# Altium project TeensyCANcaper.PrjPcb
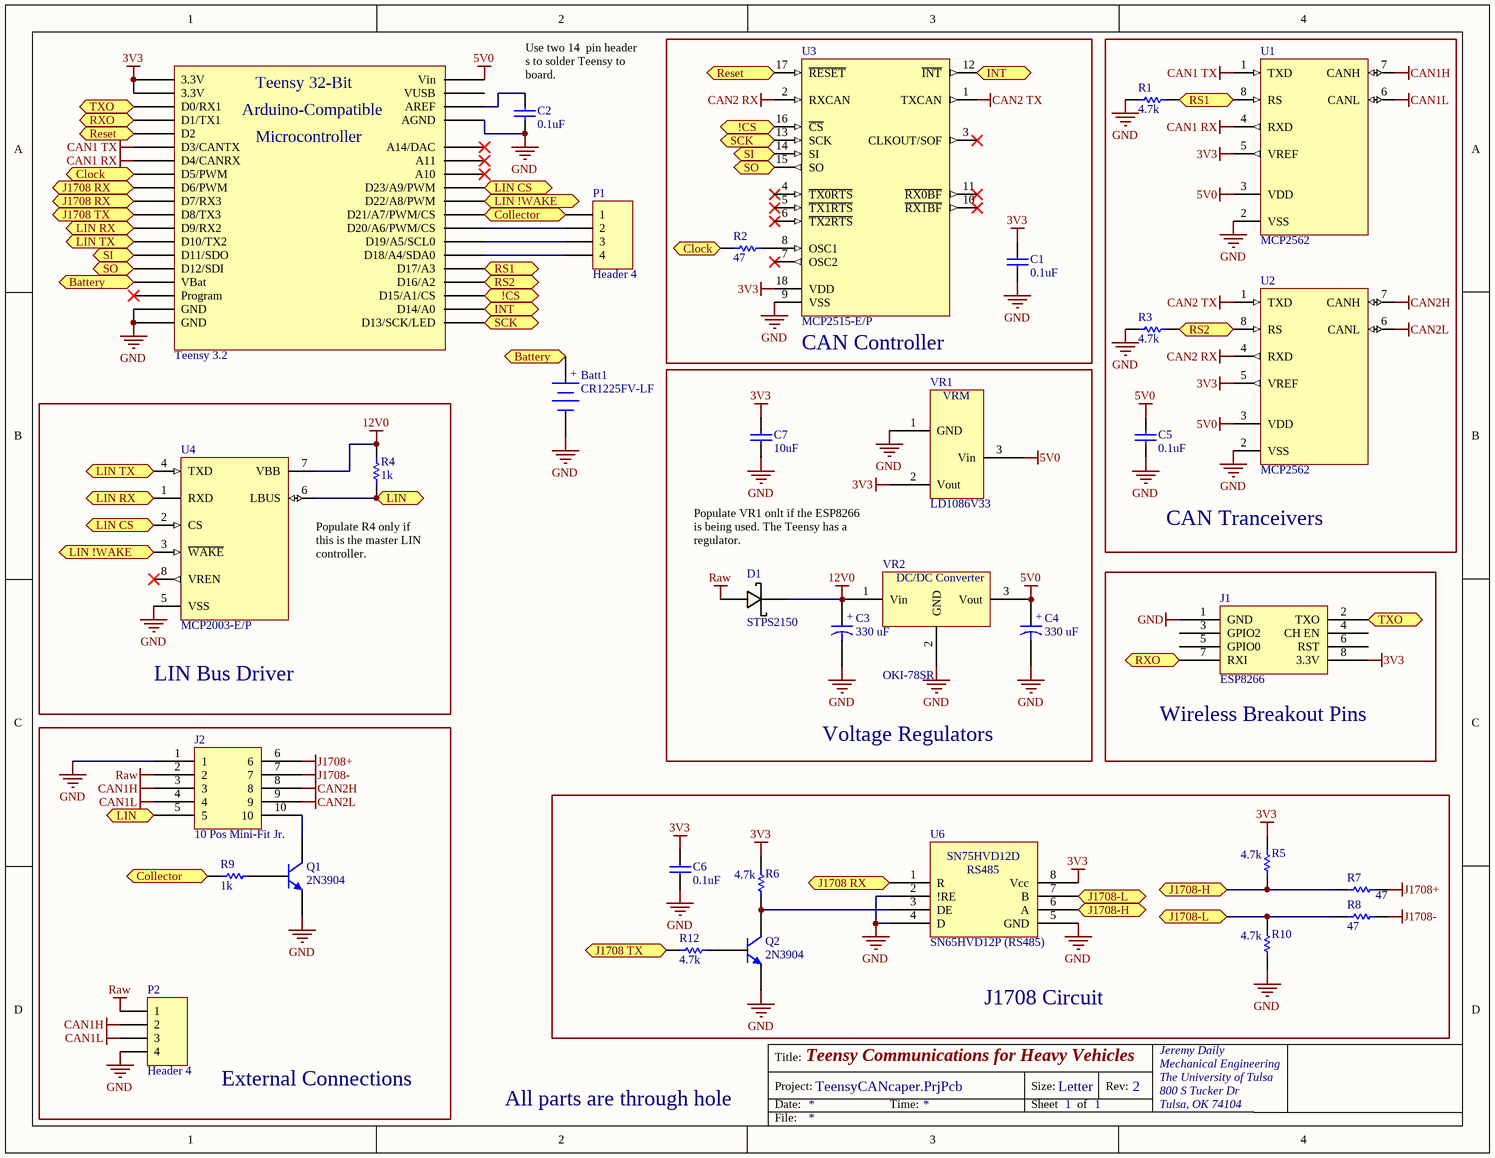
[diagram p0: TeensyJ1939v2.SchDoc]
1 sheet, 34 parts. Net scope: flat (ports and power ports of the same name join across sheets).
Board file: TeensyJ1939v2.PcbDoc

## Sheet TeensyJ1939v2.SchDoc: Teensy Communications for Heavy Vehicles
size Letter; Author: Jeremy Daily; Organization: Mechanical Engineering; Address1: The University of Tulsa; Address2: 800 S Tucker Dr; Address3: Tulsa, OK 74104; Revision: 2; SheetNumber: 1; SheetTotal: 1

### Parts
Batt1  CR1225FV-LF  [Coin Cell with Tabs]
BRD1  Teensy 3.2  [Teensy]
C1  0.1uF  [RAD-0.2]
C2  0.1uF  [RAD-0.2]
C3  330 uF  [Elec. Cap 5 x 10mm]
C4  330 uF  [Elec. Cap 5 x 10mm]
C5  0.1uF  [RAD-0.2]
C6  0.1uF  [RAD-0.2]
C7  10uF  [RAD-0.2]
D1  STPS2150  [DIODE-0.7]
J1  ESP8266  [ESP8266]
J2  10 Pos Mini-Fit Jr.  [10 pos Mini-Fit Jr. R/A Header]
P1  Header 4  [HDR1X4]
P2  Header 4  [HDR1X4]
Q1  2N3904  [TO-92A]
Q2  2N3904  [TO-92A]
R1  4.7k  [Axial-0.4]
R2  47  [Axial-0.4]
R3  4.7k  [Axial-0.4]
R4  1k  [Axial-0.4]
R5  4.7k  [Axial-0.4]
R6  4.7k  [Axial-0.4]
R7  47  [Axial-0.4]
R8  47  [Axial-0.4]
R9  1k  [Axial-0.4]
R10  4.7k  [Axial-0.4]
R12  4.7k  [Axial-0.4]
U1  MCP2562  [PDIP300-P8]
U2  MCP2562  [PDIP300-P8]
U3  MCP2515-E/P  [PDIP300-P18]
U4  MCP2003-E/P  [DIP8]
U6  SN65HVD12P (RS485)  [DIP8]
VR1  LD1086V33  [TO-220AB]
VR2  OKI-78SR  [TO-220AB]

### Blocks framed on the sheet
CAN Controller: C1 R2 U3
CAN Tranceivers: C5 R1 R3 U1 U2
LIN Bus Driver: R4 U4
Voltage Regulators: C3 C4 C7 D1 VR1 VR2
Wireless Breakout Pins: J1
External Connections: J2 P2 Q1 R9
J1708 Circuit: C6 Q2 R5-R8 R10 R12 U6

### Ports
!CS, Battery, Clock, Collector, INT, J1708 RX, J1708 TX, J1708-H, J1708-L, LIN, LIN !WAKE, LIN CS, LIN RX, LIN TX, Reset, RS1, RS2, RXO, SCK, SI, SO, TXO

### Nets
3V3: BRD1.16(3.3V) BRD1.31(3.3V) C1.2 C6.2 C7.2 J1.8(3.3V) R5.1 R6.1 U1.5(VREF) U2.5(VREF) U3.18(VDD) U6.8(Vcc) VR1.2(Vout)
5V0: BRD1.33(Vin) C4.1 C5.2 U1.3(VDD) U2.3(VDD) VR1.3(Vin) VR2.3(Vout)
12V0: C3.1 D1.2(K) R4.1 U4.7(VBB) VR2.1(Vin)
CAN1 RX: BRD1.9(D4/CANRX) U1.4(RXD)
CAN1 TX: BRD1.10(D3/CANTX) U1.1(TXD)
CAN1H: J2.3 P2.2 U1.7(CANH)
CAN1L: J2.4 P2.3 U1.6(CANL)
CAN2 RX: U2.4(RXD) U3.2(RXCAN)
CAN2 TX: U2.1(TXD) U3.1(TXCAN)
CAN2H: J2.8 U2.7(CANH)
CAN2L: J2.9 U2.6(CANL)
GND: Batt1.2(-) BRD1.14(GND) BRD1.17(GND) BRD1.32(AGND) C1.1 C2.1 C3.2(-) C4.2(-) C5.1 C6.1 C7.1 J1.1(GND) J2.1 P2.4 Q1.1(E) Q2.1(E) R1.1 R3.1 R10.2 U1.2(VSS) U2.2(VSS) U3.9(VSS) U4.5(VSS) U6.2(!RE) U6.4(D) U6.5(GND) VR1.1(GND) VR2.2(GND)
J1708+: J2.6 R7.2
J1708-: J2.7 R8.2
Raw: D1.1(A) J2.2 P2.1
NetBatt1_1: Batt1.1(+) BRD1.15(VBat) ; port Battery
NetBRD1_1: BRD1.1(D12/SDI) U3.15(SO) ; port SO
NetBRD1_2: BRD1.2(D11/SDO) U3.14(SI) ; port SI
NetBRD1_3: BRD1.3(D10/TX2) U4.4(TXD) ; port LIN TX
NetBRD1_4: BRD1.4(D9/RX2) U4.1(RXD) ; port LIN RX
NetBRD1_5: BRD1.5(D8/TX3) R12.2 ; port J1708 TX
NetBRD1_6: BRD1.6(D7/RX3) BRD1.7(D6/PWM) U6.1(R) ; port J1708 RX
NetBRD1_8: BRD1.8(D5/PWM) R2.2 ; port Clock
NetBRD1_11: BRD1.11(D2) U3.17(~{RESET}) ; port Reset
NetBRD1_12: BRD1.12(D1/TX1) J1.7(RXI) ; port RXO
NetBRD1_13: BRD1.13(D0/RX1) J1.2(TXO) ; port TXO
NetBRD1_20: BRD1.20(D13/SCK/LED) U3.13(SCK) ; port SCK
NetBRD1_21: BRD1.21(D14/A0) U3.12(~{INT}) ; port INT
NetBRD1_22: BRD1.22(D15/A1/CS) U3.16(~{CS}) ; port !CS
NetBRD1_23: BRD1.23(D16/A2) R3.2 U2.8(RS) ; port RS2
NetBRD1_24: BRD1.24(D17/A3) R1.2 U1.8(RS) ; port RS1
NetBRD1_25: BRD1.25(D18/A4/SDA0) P1.4
NetBRD1_26: BRD1.26(D19/A5/SCL0) P1.3
NetBRD1_27: BRD1.27(D20/A6/PWM/CS) P1.2
NetBRD1_28: BRD1.28(D21/A7/PWM/CS) P1.1 R9.1 ; port Collector
NetBRD1_29: BRD1.29(D22/A8/PWM) U4.3(~{WAKE}) ; port LIN !WAKE
NetBRD1_30: BRD1.30(D23/A9/PWM) U4.2(CS) ; port LIN CS
NetBRD1_35: BRD1.35(AREF) C2.2
NetJ2_5: J2.5 R4.2 U4.6(LBUS) ; port LIN
NetJ2_10: J2.10 Q1.3(C)
NetQ1_2: Q1.2(B) R9.2
NetQ2_2: Q2.2(B) R12.1
NetQ2_3: Q2.3(C) R6.2 U6.3(DE)
NetR2_1: R2.1 U3.8(OSC1)
NetR5_2: R5.2 R7.1 U6.6(A) ; port J1708-H
NetR8_1: R8.1 R10.1 U6.7(B) ; port J1708-L

Not connected (* = marked no-connect by the designer): BRD1 18(Program)* 19(A14/DAC)* 34(VUSB) 36(A10)* 37(A11)*; J1 3(GPIO2) 4(CH_EN) 5(GPIO0) 6(RST); U3 3(CLKOUT/SOF)* 4(~{TX0RTS})* 5(~{TX1RTS})* 6(~{TX2RTS})* 7(OSC2)* 10(~{RX1BF})* 11(~{RX0BF})*; U4 8(VREN)*

### Notes on the sheet
- (near C2) Use two 14  pin header s to solder Teensy to board.
- Populate R4 only if this is the master LIN controller.
- Populate VR1 onlt if the ESP8266 is being used. The Teensy has a regulator.
- All parts are through hole
- Title:
- Project:
- Date:
- Time:
- Sheet
- Size:
- Letter
- of
- Rev:
- File:
- (in symbol 7805) DC/DC Converter
- (in symbol Electrolytic Cap) +
- (in symbol LD1086 VRM) VRM
- (in symbol SN75HVD12D (3.3v RS485)) SN75HVD12D; RS485
- (in symbol Teensy) Teensy 32-Bit; Arduino-Compatible; Microcontroller

### Library data of the parts
Batt1 = CR2032 Battery Holder: Coin Cell Battery 3V 2-PIN VERT 48mAh 12.5 x 2.5mm; Manufacturer: Renata; Supplier 1: Mouser; Supplier Part Number 1: 614-CR1225FV-LF; PartNumber: CR1225FV-LF
BRD1 = Teensy: 32 Bit Arduino-Compatible Microcontroller; Manufacturer: PRJC; PartNumber: Teensy 3.2; Supplier 1: Sparkfun; Supplier Part Number 1: DEV-13736
C1 C2 C5 C6 = Cap: Multilayer Ceramic Capacitors MLCC - Leaded 50volts 0.1uF 10% X7R; Manufacturer: AVX; PartNumber: SR215C104KAA; Supplier 1: Mouser; Supplier Part Number 1: 581-SR215C104K
C3 C4 = Electrolytic Cap: Aluminum Electrolytic Capacitors - Leaded 330uF 35V; Manufacturer: Panasonic Electronic Components; PartNumber: EEU-FC1V331; Supplier 1: Mouser; Supplier Part Number 1: 667-EEU-FC1V331
C7 = Cap: Multilayer Ceramic Capacitors MLCC - Leaded 50volts 10uF 10% X7R; Manufacturer: AVX; PartNumber: SR655C106KAR; Supplier 1: Mouser; Supplier Part Number 1: 581-SR655C106KAR
D1 = Schottky Diode: DIODE SCHOTTKY 60V 2A AXIAL; Manufacturer: STMicroelectronics; Supplier 1: Mouser; Supplier Part Number 1: 511-STPS2150; PartNumber: STPS2150
J1 = ESP8266: Sparkfun ESP8266 Module (WRL-13678); Manufacturer: Espressif; PartNumber: ESP8266; Supplier 1: Sparkfun; Supplier Part Number 1: WRL-13678
J2 = 10 Pos Header: Headers & Wire Housings 10 CKT R/A HEADER; Manufacturer: Molex; Supplier 1: Mouser; PartNumber: 39-30-1100; Supplier Part Number 1: 538-39-30-1100
P1 = Header 4: Pin headers for Teensy; Manufacturer: 3M Electronic Solutions Division; PartNumber: 929984-01-28; Supplier 1: Mouser; Supplier Part Number 1: 517-929984-01-28
P2 = Header 4: Pin headers for Teensy; Manufacturer: 3M Electronic Solutions Division; PartNumber: 929400-01-28-RK; Supplier 1: Mouser; Supplier Part Number 1: 517-929400-01-28-RK
Q1 Q2 = 2N3904: NPN General Purpose Amplifier; Manufacturer: Central Semiconductor; PartNumber: 2N3904; Supplier 1: Mouser; Supplier Part Number 1: 610-2N3904
R1 R3 R5 R6 R10 R12 = Chip Resistor: Metal Film Resistors - Through Hole 4.7K OHM 1/4W 1%; Manufacturer: Yageo; PartNumber: MFR-25FRF52-4K7; Supplier 1: Mouser; Supplier Part Number 1: 603-MFR-25FRF52-4K7
R2 R7 R8 = Chip Resistor: Metal Film Resistors - Through Hole 47 OHM 1/4W 1%; Manufacturer: Yageo; PartNumber: MFR-25FRF52-47R; Supplier 1: Mouser; Supplier Part Number 1: 603-MFR-25FRF52-47R
R4 R9 = Chip Resistor: Metal Film Resistors - Through Hole 1K ohm 1/4W 1%; Manufacturer: Yageo; PartNumber: MFR-25FRF52-1K; Supplier 1: Mouser; Supplier Part Number 1: 603-MFR-25FRF521K
U1 U2 = MCP2551-I/P: High-Speed CAN Transceiver, 8-Pin PDIP, Industrial Temperature; Manufacturer: Microchip; PartNumber: MCP2562-E/P; Supplier 1: Mouser; Supplier Part Number 1: 579-MCP2562-E/P
U3 = MCP2515-E/P: Stand-Alone CAN Controller With SPI Interface, 18-Pin PDIP, Extended Temperature; Manufacturer: Microchip; Supplier 1: Mouser; Supplier Part Number 1: 579-MCP2515-E/P; PartNumber: MCP2515-E/P
U4 = MCP2003AT-E/SN: TXRX LIN BUS BIDIRECT 8DIP; Manufacturer: Microchip; Supplier 1: Mouser; Supplier Part Number 1: 579-MCP2003EP; PartNumber: MCP2003-E/P
U6 = SN75HVD12D (3.3v RS485): RS-485 Interface IC 3.3V RS485; Manufacturer: Texas Instruments; PartNumber: SN65HVD12P; Supplier 1: Mouser; Supplier Part Number 1: 595-SN65HVD12P
VR1 = LD1086 VRM: IC REG LDO 3.3V 1.5A TO220AB; Manufacturer: STMicroelectronics; PartNumber: LD1086D2M33TR; Supplier 1: Mouser; Supplier Part Number 1: 511-LD1086D2M33-TR
VR2 = 7805: 5V DC/DC Converter (7805 replacement); Manufacturer: Murata Power Solutions; PartNumber: OKI-78SR-5/1.5-W36-C; Supplier 1: Mouser; Supplier Part Number 1: 580-OKI78SR5/1.5W36C